# Altium schematic sheet Sheet2.SchDoc
size A4; SheetNumber: 1; SheetTotal: 1
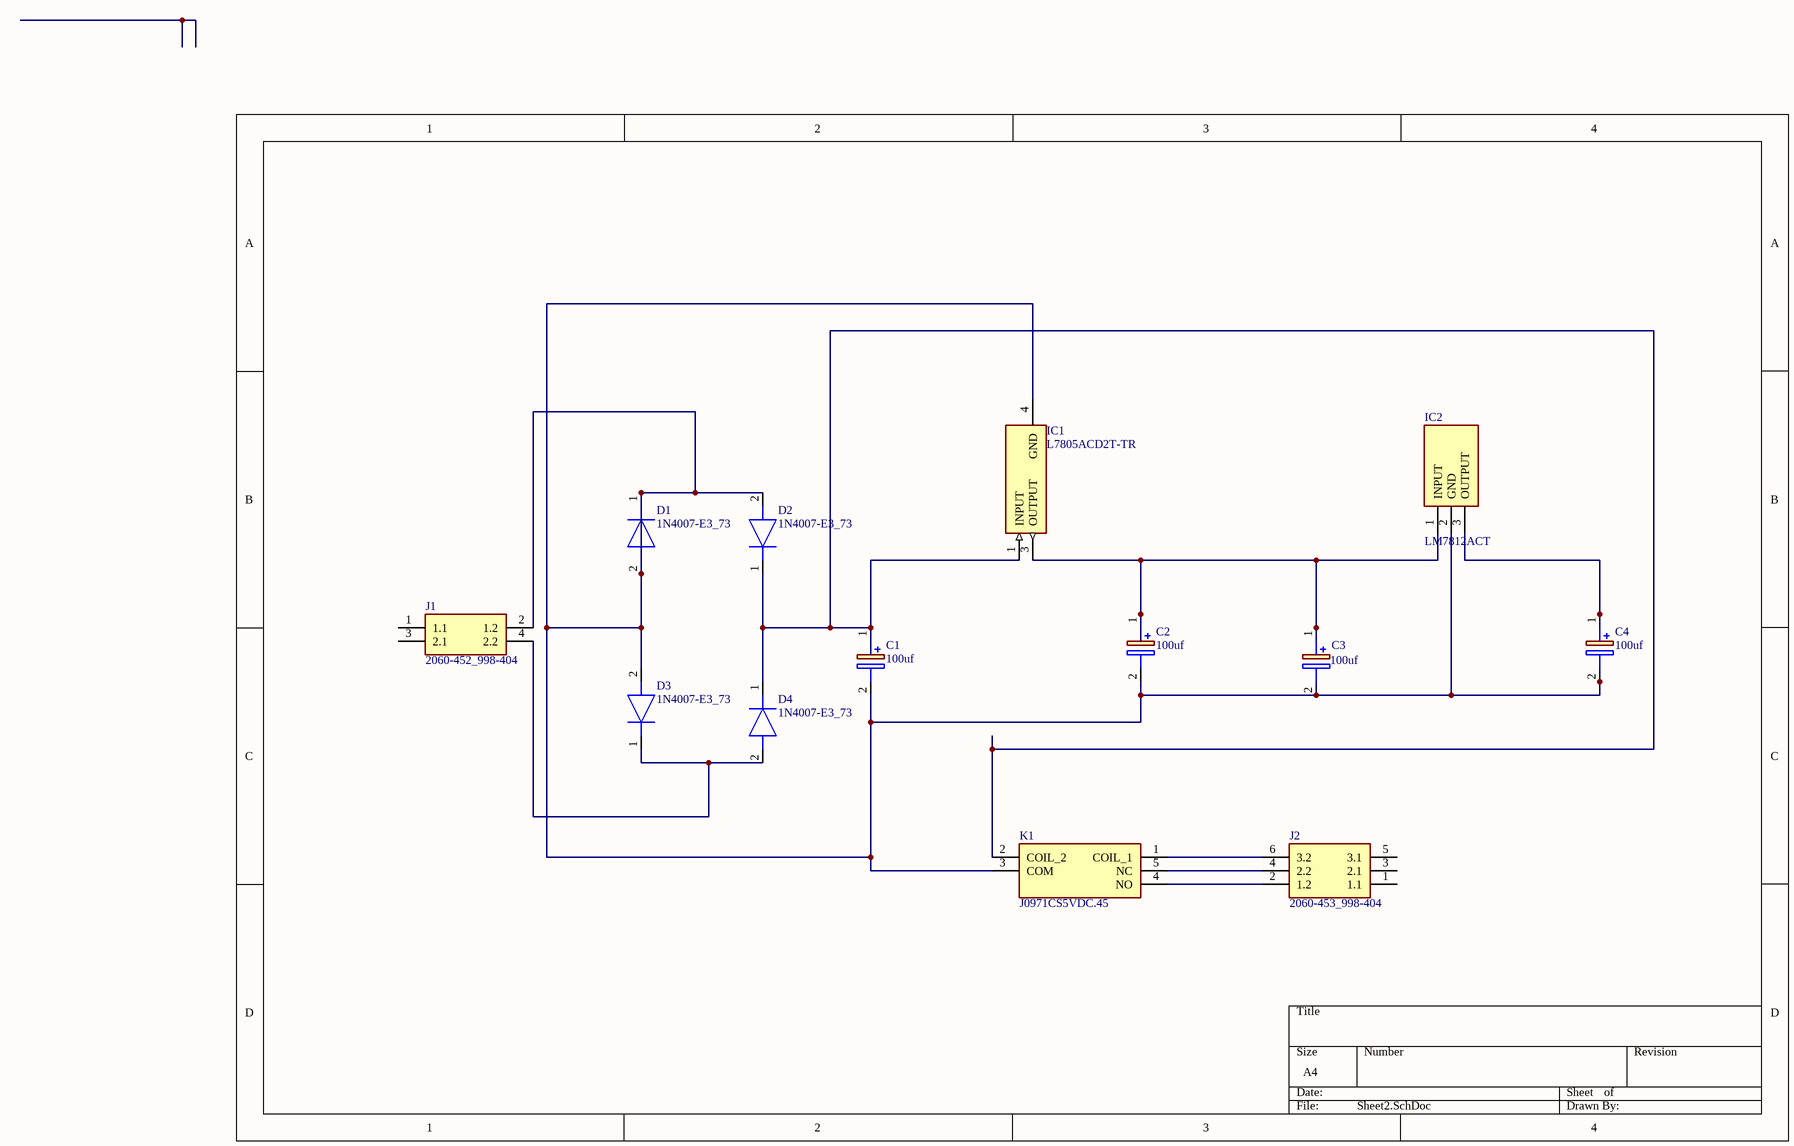
[diagram p0: Sheet2.SchDoc]

## Parts
C1  100uf  [CAPPRD500W65D1250H2700]
C2  100uf  [CAPPRD500W65D1250H2700]
C3  100uf  [CAPPRD500W65D1250H2700]
C4  100uf  [CAPPRD500W65D1250H2700]
D1  1N4007-E3_73  [DIOAD1405W86L465D235]
D2  1N4007-E3_73  [DIOAD1405W86L465D235]
D3  1N4007-E3_73  [DIOAD1405W86L465D235]
D4  1N4007-E3_73  [DIOAD1405W86L465D235]
IC1  L7805ACD2T-TR  [D2PAK-STB35NF10T4]
IC2  LM7812ACT  [TO254P470X1016X2019-3P]
J1  2060-452_998-404  [2060452998404]
J2  2060-453_998-404  [2060453998404]
K1  J0971CS5VDC.45  [J0971CS5VDC45]

## Nets
NetC1_1: C1.1(+) D2.1(K) D4.1(K) IC1.1(INPUT) K1.2(COIL_2)
NetC1_2: C1.2(-) C2.2(-) C3.2(-) C4.2(-) D1.1(K) D1.2(A) D2.2(A) D3.2(A) IC1.4(GND) IC2.2(GND) J1.2(1.2) K1.3(COM)
NetC2_1: C2.1(+) C3.1(+) IC1.3(OUTPUT) IC2.1(INPUT)
NetC4_1: C4.1(+) IC2.3(OUTPUT)
NetD3_1: D3.1(K) D4.2(A) J1.4(2.2)
NetJ2_2: J2.2(1.2) K1.4(NO)
NetJ2_4: J2.4(2.2) K1.5(NC)
NetJ2_6: J2.6(3.2) K1.1(COIL_1)

Not connected (* = marked no-connect by the designer): J1 1(1.1) 3(2.1); J2 1(1.1) 3(2.1) 5(3.1)

## Library data of the parts
C1-C4 = EEUTA1E102LB: Capacitor Polarised; Manufacturer_Name: Panasonic; Datasheet Link: http://industrial.panasonic.com/cdbs/www-data/pdf/RDF0000/ABA0000C1212.pdf; Height: 27mm; Manufacturer_Part_Number: EEUTA1E102LB
D1-D4 = 1N4007-E3_73: Diode; Manufacturer_Name: Vishay; Manufacturer_Part_Number: 1N4007-E3/73; Datasheet Link: https://mouser.componentsearchengine.com/Datasheets/2/1N4007-E3_73.pdf; Mouser Part Number: 625-1N4007-E3/73; Mouser Price/Stock: https://www.mouser.co.uk/ProductDetail/Vishay-General-Semiconductor/1N4007-E3-73?qs=N4vtoAxH%2FSqT3Ng3e4K0Gw%3D%3D; Arrow Part Number: 1N4007-E3/73; Arrow Price/Stock: https://www.arrow.com/en/products/1n4007-e373/vishay?region=europe
IC1 = L7805ACD2T-TR: Integrated Circuit; Manufacturer_Name: STMicroelectronics; Datasheet Link: http://www.st.com/web/en/resource/technical/document/datasheet/CD00000444.pdf; Manufacturer_Part_Number: L7805ACD2T-TR; Mouser Part Number: 511-L7805ACD2T-TR; Mouser Price/Stock: https://www.mouser.co.uk/ProductDetail/STMicroelectronics/L7805ACD2T-TR?qs=Ctxo64yJVFuOLXlPPZdJUQ%3D%3D; Arrow Part Number: L7805ACD2T-TR; Arrow Price/Stock: https://www.arrow.com/en/products/l7805acd2t-tr/stmicroelectronics?region=europe
IC2 = LM7812ACT: Integrated Circuit; Manufacturer_Name: onsemi; Datasheet Link: https://datasheet.datasheetarchive.com/originals/distributors/Datasheets_SAMA/704b005d7d2d9ced5864f40b6609c1bc.pdf; Height: 4.7mm; Manufacturer_Part_Number: LM7812ACT; Mouser Part Number: 512-LM7812ACT; Mouser Price/Stock: https://www.mouser.com/Search/Refine.aspx?Keyword=512-LM7812ACT; Arrow Part Number: LM7812ACT; Arrow Price/Stock: https://www.arrow.com/en/products/lm7812act/on-semiconductor
J1 = 2060-452_998-404: Connector; Manufacturer_Name: Wago; Manufacturer_Part_Number: 2060-452/998-404; Datasheet Link: https://www.wago.com/2060-452/998-404; Height: 4.5mm; Arrow Part Number: 2060-452/998-404; Arrow Price/Stock: https://www.arrow.com/en/products/2060-452998-404/wago-kontakttechnik-gmbh?region=nac
J2 = 2060-453_998-404: Connector; Manufacturer_Name: Wago; Manufacturer_Part_Number: 2060-453/998-404; Datasheet Link: https://www.wago.com/2060-453/998-404; Height: 4.5mm; Arrow Part Number: 2060-453/998-404; Arrow Price/Stock: https://www.arrow.com/en/products/2060-453998-404/wago-kontakttechnik-gmbh?region=europe
K1 = J0971CS5VDC.45: Relay or Contactor; Manufacturer_Name: CIT Relay & Switch; Datasheet Link: https://www.citrelay.com/Catalog Pages/RelayCatalog/J097.pdf; Height: 15.3mm; Manufacturer_Part_Number: J0971CS5VDC.45